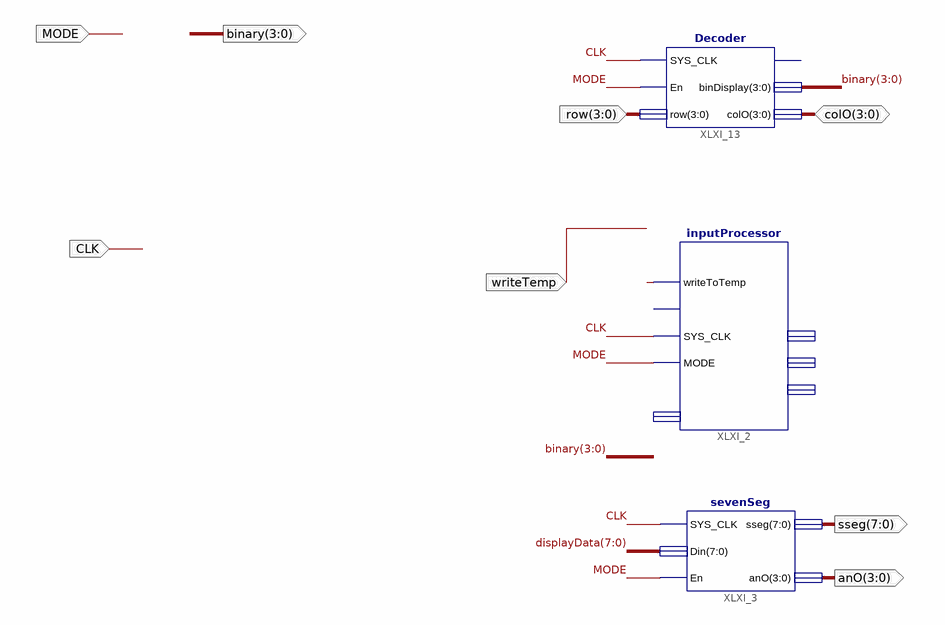
[diagram p0: schematic sheet 1]
// Xilinx ISE schematic testingDisplay.sch (spartan3e) as structural Verilog: 3 symbols, 8 ports
module testingDisplay (
  input  MODE,
  input  writeTemp,
  input  [3:0] row,
  input  CLK,
  inout  [3:0] colO,
  output [3:0] binary,
  output [7:0] sseg,
  output [3:0] anO
);

  wire [7:0] displayData;

  inputProcessor XLXI_2 (
    .SYS_CLK(CLK), .writeToTemp(writeTemp), .MODE(MODE));  // open: binaryInput, writeToMM, opCode, immediate, displayData
  sevenSeg XLXI_3 (.SYS_CLK(CLK), .Din(displayData), .En(MODE), .sseg(sseg), .anO(anO));
  Decoder XLXI_13 (.SYS_CLK(CLK), .En(MODE), .row(row), .colO(colO), .binDisplay(binary));  // open: keyO
endmodule
